# Altium schematic sheet Test_Points.SchDoc: Test Points
size A4; DocumentNumber: 22; SheetNumber: 22; SheetTotal: 51
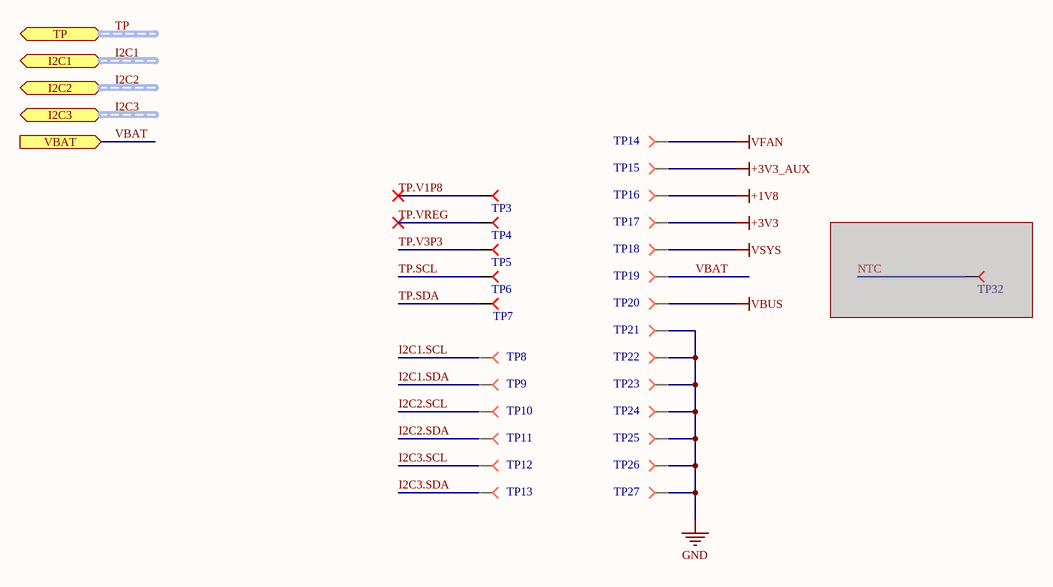
[diagram p0: Test_Points.SchDoc]

## Parts
TP3  Test Point Pad  [Testpoint]  (value not drawn)  (no BOM)
TP4  Test Point Pad  [Testpoint]  (value not drawn)  (no BOM)
TP5  Test Point Pad  [Testpoint]  (value not drawn)  (no BOM)
TP6  Test Point Pad  [Testpoint]  (value not drawn)  (no BOM)
TP7  Test Point Pad  [Testpoint]  (value not drawn)  (no BOM)
TP8  Test Point Pad  [Testpoint]  (value not drawn)  (no BOM)
TP9  Test Point Pad  [Testpoint]  (value not drawn)  (no BOM)
TP10  Test Point Pad  [Testpoint]  (value not drawn)  (no BOM)
TP11  Test Point Pad  [Testpoint]  (value not drawn)  (no BOM)
TP12  Test Point Pad  [Testpoint]  (value not drawn)  (no BOM)
TP13  Test Point Pad  [Testpoint]  (value not drawn)  (no BOM)
TP14  Test Point Pad  [Testpoint]  (value not drawn)  (no BOM)
TP15  Test Point Pad  [Testpoint]  (value not drawn)  (no BOM)
TP16  Test Point Pad  [Testpoint]  (value not drawn)  (no BOM)
TP17  Test Point Pad  [Testpoint]  (value not drawn)  (no BOM)
TP18  Test Point Pad  [Testpoint]  (value not drawn)  (no BOM)
TP19  Test Point Pad  [Testpoint]  (value not drawn)  (no BOM)
TP20  Test Point Pad  [Testpoint]  (value not drawn)  (no BOM)
TP21  Test Point Pad  [Testpoint]  (value not drawn)  (no BOM)
TP22  Test Point Pad  [Testpoint]  (value not drawn)  (no BOM)
TP23  Test Point Pad  [Testpoint]  (value not drawn)  (no BOM)
TP24  Test Point Pad  [Testpoint]  (value not drawn)  (no BOM)
TP25  Test Point Pad  [Testpoint]  (value not drawn)  (no BOM)
TP26  Test Point Pad  [Testpoint]  (value not drawn)  (no BOM)
TP27  Test Point Pad  [Testpoint]  (value not drawn)  (no BOM)
TP32  Test Point Pad  [Testpoint]  (value not drawn)  (no BOM)  (masked out: inside a compile mask, not in the netlist)

## Ports
I2C1 (harness I2C), I2C2 (harness I2C), I2C3 (harness I2C), TP (harness DRV10975_TP), VBAT (in)

## Nets
+1V8: TP16.1
+3V3: TP17.1
+3V3_AUX: TP15.1
GND: TP21.1 TP22.1 TP23.1 TP24.1 TP25.1 TP26.1 TP27.1
VBUS: TP20.1
VFAN: TP14.1
VSYS: TP18.1
I2C1.SCL: TP8.1
I2C1.SDA: TP9.1
I2C2.SCL: TP10.1
I2C2.SDA: TP11.1
I2C3.SCL: TP12.1
I2C3.SDA: TP13.1
TP.SCL: TP6.1
TP.SDA: TP7.1
TP.V1P8: TP3.1
TP.V3P3: TP5.1
TP.VREG: TP4.1
VBAT: TP19.1 ; port VBAT

## Buses and harness runs
harness I2C1 = port I2C1
harness I2C2 = port I2C2
harness I2C3 = port I2C3
harness TP = port TP

## Notes on the sheet
- Title
- Size:
- Date:
- A4
- Number:
- Time:
- Revision:
- Sheet
- of
- File:

## Library data of the parts
TP3-TP27 TP32 = Test Point Pad: Test Point. There is nothing to buy or mount.; ClassName: TestPoint; CompType: TestPoint; Manufacturer: N/A; MountType: N/A; PackageReference: TetsPoint; PartNumber: N/A